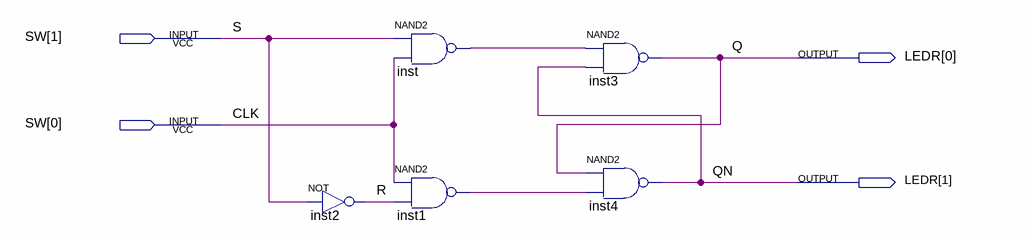
[diagram p0: schematic sheet]
// Quartus schematic lab4b.bdf as structural Verilog: 5 symbols, 4 pins
module lab4b (
  input  [1:0] SW,
  output [1:0] LEDR
);

  wire inst1_out, inst_out, R;

  not inst2 (R, SW[1]);
  nand inst (inst_out, SW[1], SW[0]);
  nand inst1 (inst1_out, SW[0], R);
  nand inst3 (LEDR[0], inst_out, LEDR[1]);
  nand inst4 (LEDR[1], LEDR[0], inst1_out);

  // Other names for the same wires on the sheet: CLK = SW[0]; Q = LEDR[0]; QN = LEDR[1]; S = SW[1]
endmodule
